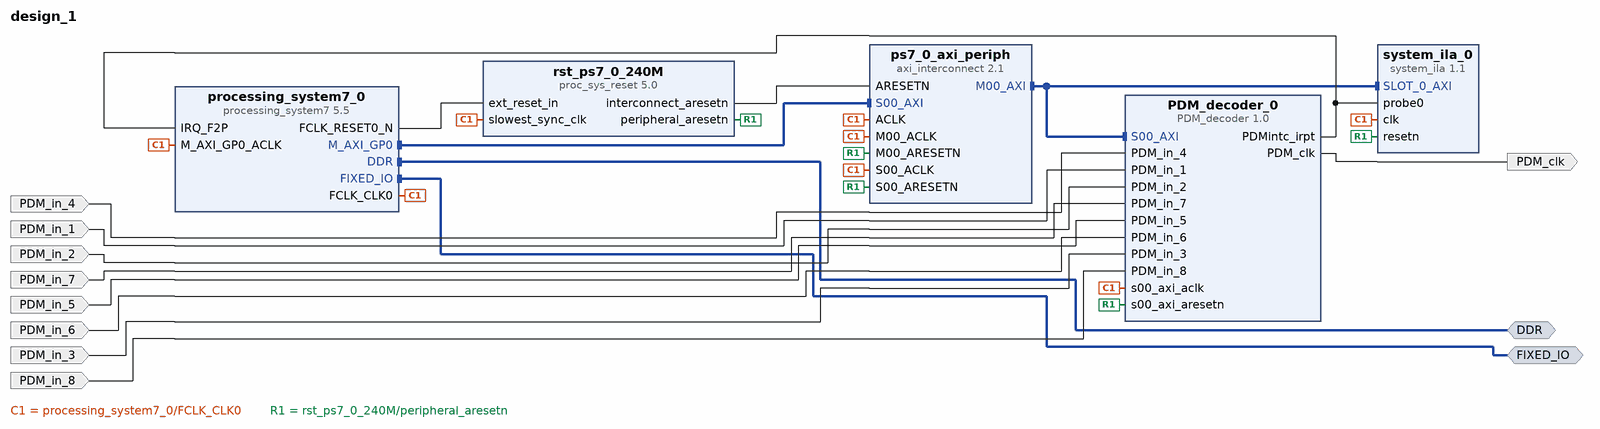
[diagram p0: block diagram of the top level]
# Vivado block design design_1, xc7z020clg400-2, Vivado 2017.4
create_bd_design design_1

create_bd_intf_port -mode Master -vlnv xilinx.com:interface:ddrx_rtl:1.0 DDR
create_bd_intf_port -mode Master -vlnv xilinx.com:display_processing_system7:fixedio_rtl:1.0 FIXED_IO
create_bd_port -dir I PDM_in_4
create_bd_port -dir I PDM_in_1
create_bd_port -dir I PDM_in_2
create_bd_port -dir I PDM_in_7
create_bd_port -dir I PDM_in_5
create_bd_port -dir I PDM_in_6
create_bd_port -dir I PDM_in_3
create_bd_port -dir I PDM_in_8
create_bd_port -dir O -type clk PDM_clk

create_bd_cell -type ip -vlnv xilinx.com:ip:processing_system7:5.5 processing_system7_0
set_property -dict [list \
  CONFIG.PCW_SDIO_PERIPHERAL_FREQMHZ 100 \
  CONFIG.PCW_UART_PERIPHERAL_FREQMHZ 100 \
  CONFIG.PCW_FPGA0_PERIPHERAL_FREQMHZ 240 \
  CONFIG.PCW_USE_FABRIC_INTERRUPT 1 \
  CONFIG.PCW_IRQ_F2P_INTR 1 \
  CONFIG.PCW_PRESET_BANK1_VOLTAGE {LVCMOS 1.8V} \
  CONFIG.PCW_UIPARAM_DDR_PARTNO {MT41J256M16 RE-125} \
  CONFIG.PCW_SD0_PERIPHERAL_ENABLE 1 \
  CONFIG.PCW_SD0_SD0_IO {MIO 40 .. 45} \
  CONFIG.PCW_SD0_GRP_CD_ENABLE 1 \
  CONFIG.PCW_SD0_GRP_CD_IO {MIO 47} \
  CONFIG.PCW_SD0_GRP_WP_ENABLE 0 \
  CONFIG.PCW_UART1_PERIPHERAL_ENABLE 1 \
  CONFIG.PCW_UART1_UART1_IO {MIO 48 .. 49} \
] [get_bd_cells processing_system7_0]
# 66 more settings of processing_system7_0 are not shown: defaults, MIO pin electricals, DDR timing, and values the tool derives
create_bd_cell -type ip -vlnv xilinx.com:ip:axi_interconnect:2.1 ps7_0_axi_periph
set_property -dict {CONFIG.NUM_MI 1} [get_bd_cells ps7_0_axi_periph]
create_bd_cell -type ip -vlnv xilinx.com:ip:proc_sys_reset:5.0 rst_ps7_0_240M
create_bd_cell -type ip -vlnv xilinx.com:ip:system_ila:1.1 system_ila_0
set_property -dict {CONFIG.C_DATA_DEPTH 16384 CONFIG.C_MON_TYPE MIX} [get_bd_cells system_ila_0]
create_bd_cell -type ip -vlnv xilinx.com:user:PDM_decoder:1.0 PDM_decoder_0

# ---- connections ----

connect_bd_intf_net [get_bd_intf_pins processing_system7_0/M_AXI_GP0] [get_bd_intf_pins ps7_0_axi_periph/S00_AXI]
connect_bd_intf_net [get_bd_intf_pins ps7_0_axi_periph/M00_AXI] [get_bd_intf_pins PDM_decoder_0/S00_AXI]
connect_bd_intf_net [get_bd_intf_pins ps7_0_axi_periph/M00_AXI] [get_bd_intf_pins system_ila_0/SLOT_0_AXI]
connect_bd_intf_net [get_bd_intf_ports DDR] [get_bd_intf_pins processing_system7_0/DDR]
connect_bd_intf_net [get_bd_intf_ports FIXED_IO] [get_bd_intf_pins processing_system7_0/FIXED_IO]
connect_bd_net [get_bd_pins processing_system7_0/FCLK_CLK0] \
  [get_bd_pins processing_system7_0/M_AXI_GP0_ACLK] [get_bd_pins rst_ps7_0_240M/slowest_sync_clk] \
  [get_bd_pins system_ila_0/clk] [get_bd_pins PDM_decoder_0/s00_axi_aclk] [get_bd_pins ps7_0_axi_periph/ACLK] \
  [get_bd_pins ps7_0_axi_periph/S00_ACLK] [get_bd_pins ps7_0_axi_periph/M00_ACLK]
connect_bd_net [get_bd_pins processing_system7_0/FCLK_RESET0_N] [get_bd_pins rst_ps7_0_240M/ext_reset_in]
connect_bd_net [get_bd_pins rst_ps7_0_240M/peripheral_aresetn] \
  [get_bd_pins system_ila_0/resetn] [get_bd_pins PDM_decoder_0/s00_axi_aresetn] [get_bd_pins ps7_0_axi_periph/S00_ARESETN] \
  [get_bd_pins ps7_0_axi_periph/M00_ARESETN]
connect_bd_net [get_bd_pins rst_ps7_0_240M/interconnect_aresetn] [get_bd_pins ps7_0_axi_periph/ARESETN]
connect_bd_net [get_bd_pins PDM_decoder_0/PDMintc_irpt] [get_bd_pins processing_system7_0/IRQ_F2P] [get_bd_pins system_ila_0/probe0]
connect_bd_net -net PDM_in_4_0_1 [get_bd_ports PDM_in_4] [get_bd_pins PDM_decoder_0/PDM_in_4]
connect_bd_net -net PDM_in_1_0_1 [get_bd_ports PDM_in_1] [get_bd_pins PDM_decoder_0/PDM_in_1]
connect_bd_net -net PDM_in_2_0_1 [get_bd_ports PDM_in_2] [get_bd_pins PDM_decoder_0/PDM_in_2]
connect_bd_net -net PDM_in_7_0_1 [get_bd_ports PDM_in_7] [get_bd_pins PDM_decoder_0/PDM_in_7]
connect_bd_net -net PDM_in_5_0_1 [get_bd_ports PDM_in_5] [get_bd_pins PDM_decoder_0/PDM_in_5]
connect_bd_net -net PDM_in_6_0_1 [get_bd_ports PDM_in_6] [get_bd_pins PDM_decoder_0/PDM_in_6]
connect_bd_net -net PDM_in_3_0_1 [get_bd_ports PDM_in_3] [get_bd_pins PDM_decoder_0/PDM_in_3]
connect_bd_net -net PDM_in_8_0_1 [get_bd_ports PDM_in_8] [get_bd_pins PDM_decoder_0/PDM_in_8]
connect_bd_net [get_bd_pins PDM_decoder_0/PDM_clk] [get_bd_ports PDM_clk]

# ---- address map ----
assign_bd_address -offset 0x43C00000 -range 64K -target_address_space [get_bd_addr_spaces processing_system7_0/Data] [get_bd_addr_segs PDM_decoder_0/S00_AXI/S00_AXI_reg]

validate_bd_design
save_bd_design
